# Altium schematic sheet Power.SchDoc
size A2; SheetNumber: 2; SheetTotal: 2
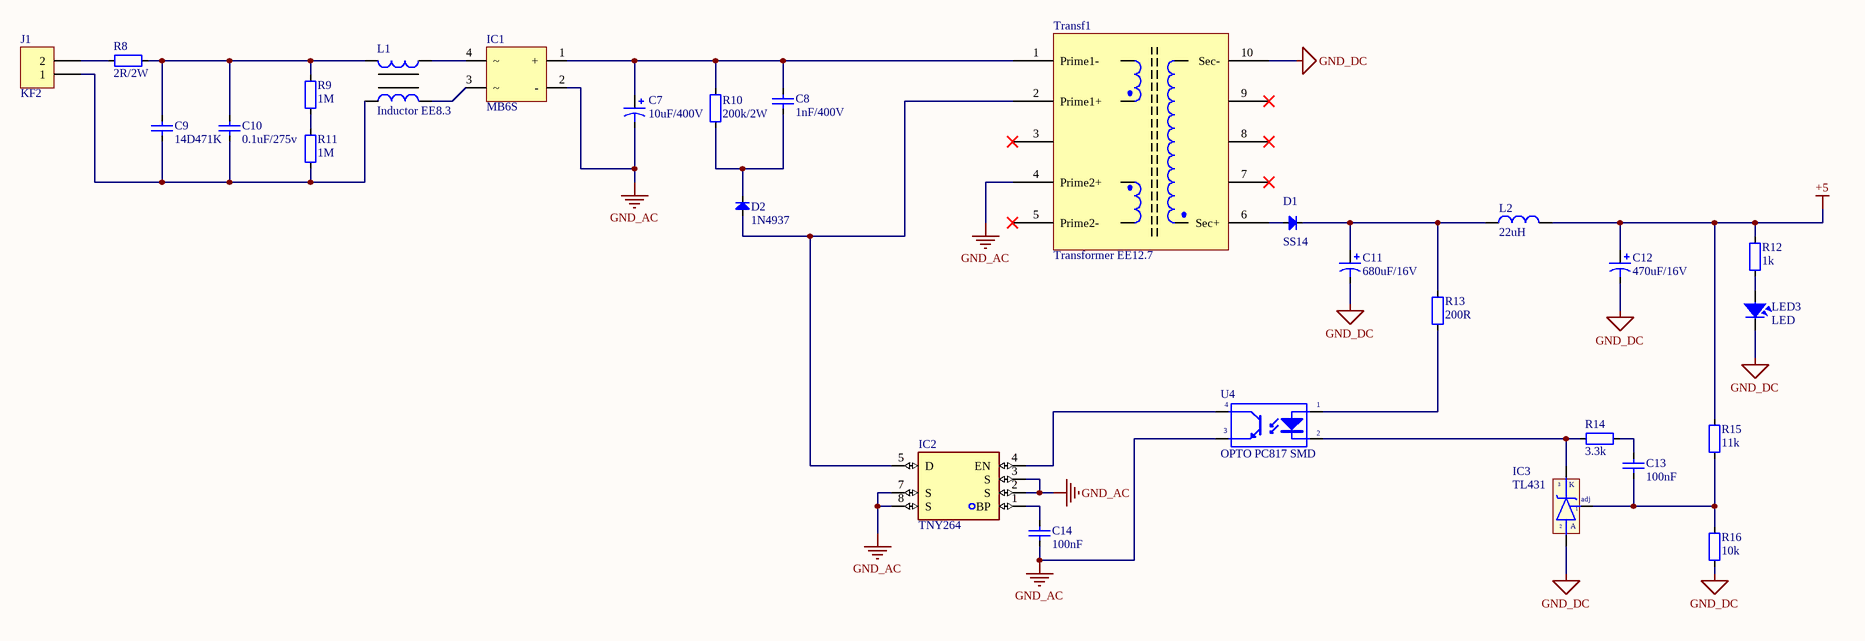
[diagram p0: Power.SchDoc]

## Parts
C7  10uF/400V  [C10mm]
C8  1nF/400V  [103/2KV]
C9  14D471K  [103/2KV]
C10  0.1uF/275v  [Cap AC filter]
C11  680uF/16V  [C8mm]
C12  470uF/16V  [C8mm]
C13  100nF  [CAP_0805]
C14  100nF  [CAP_0805]
D1  SS14  [DO-214AC(SMA)]
D2  1N4937  [DIO-1AN]
IC1  MB6S  [MB6S]
IC2  TNY264  [TNY264]
IC3  TL431  [qto-92]
J1  KF2  [KF2-5.08T]
L1  Inductor EE8.3  [Inductor EE8.3]
L2  22uH  [L_SMD]
LED3  LED  [LED-0805-Red]
R8  2R/2W  [RES-1WW]
R9  1M  [RES-SMD-1206]
R10  200k/2W  [RES-1WW]
R11  1M  [RES-SMD-1206]
R12  1k  [RES-SMD-0805]
R13  200R  [RES-SMD-0805]
R14  3.3k  [RES-SMD-0805]
R15  11k  [RES-SMD-0805]
R16  10k  [RES-SMD-0805]
Transf1  Transformer EE12.7  [Transformer EE12.7]
U4  OPTO PC817 SMD  [SOP4]

## Nets
+5: C12.1 L2.2 R12.2 R15.2
GND_AC: C7.2 C14.1 IC1.2(-) IC2.2(S) IC2.3(S) IC2.7(S) IC2.8(S) Transf1.4(Prime2+) U4.3(E)
GND_DC: C11.2 C12.2 IC3.2(A) LED3.2 R16.1 Transf1.10(Sec-)
NetC7_1: C7.1 C8.1 IC1.1(+) R10.2 Transf1.1(Prime1-)
NetC8_2: C8.2 D2.2(K) R10.1
NetC9_1: C9.1 C10.1 J1.1 L1.4 R11.1
NetC9_2: C9.2 C10.2 L1.2 R8.2 R9.2
NetC11_1: C11.1 D1.2(K) L2.1 R13.2
NetC13_1: C13.1 IC3.1(adj) R15.1 R16.2
NetC13_2: C13.2 R14.1
NetC14_2: C14.2 IC2.1(BP)
NetD1_1: D1.1(A) Transf1.6(Sec+)
NetD2_1: D2.1(A) IC2.5(D) Transf1.2(Prime1+)
NetIC1_3: IC1.3 L1.3
NetIC1_4: IC1.4 L1.1
NetIC2_4: IC2.4(EN) U4.4(C)
NetIC3_3: IC3.3(K) R14.2 U4.2(K)
NetJ1_2: J1.2 R8.1
NetLED3_1: LED3.1 R12.1
NetR9_1: R9.1 R11.2
NetR13_1: R13.1 U4.1(A)

Not connected (* = marked no-connect by the designer): Transf1 3* 5(Prime2-)* 7* 8* 9*

## Library data of the parts
C7 C11 C12 = Cap Pol: Polarized Capacitor (Axial); Published: 8-Jun-2000; LatestRevisionDate: 17-Jul-2002; LatestRevisionNote: Re-released for DXP Platform.; PackageReference: POLAR0.8; Publisher: Altium Limited
C8 = Cap2KV: CAP CERAMIC; Published: 8-Jun-2000; LatestRevisionDate: 17-Jul-2002; LatestRevisionNote: Re-released for DXP Platform.; PackageReference: RAD-0.3; Publisher: Altium Limited
C9 = Cap2KV: Capacitor Ceramic 2KV; Published: 8-Jun-2000; LatestRevisionDate: 17-Jul-2002; LatestRevisionNote: Re-released for DXP Platform.; PackageReference: RAD-0.3; Publisher: Altium Limited
C10 = Cap AC filter: Tụ lọc nguồn AC 0.1uf 275v 10mm
C13 C14 = CapSMD: Capacitor; Value: 33p; Published: 8-Jun-2000; LatestRevisionDate: 17-Jul-2002; LatestRevisionNote: Re-released for DXP Platform.; PackageReference: RAD-0.3; Publisher: Altium Limited
D1 = Diode SMD: Diode Schottky / 1N5819; Code - JEDEC: DO-214-AB; Value: 1N5007; Published: 8-Jun-2000; Revision: July-2002: Re-released for DXP Platform.; Publisher: Altium Limited
D2 = Diode SMD: Diode Schottky / 1N4937; Code - JEDEC: DO-214-AB; Value: 1N5007; Published: 8-Jun-2000; Revision: July-2002: Re-released for DXP Platform.; Publisher: Altium Limited
IC2 = TNY264: IC Power
IC3 = TL431: Programmable Shunt Regulator; Value: TL431
J1 = KF2: Manufacturer: Würth Elektronik eiSos GmbH; partNo: 691103110002; ComponentLink1 Description: Manufacturer; ComponentLink2 Description: Datasheet; NoPins: 2; Created Date: 29 October 2013; ComponentLink1URL: http://www.we-online.com; ComponentLink2URL: http://katalog.we-online.de/em/datasheet/6911031100xx.pdf; Created by: Karrer Zheng
L2 = Inductor: CD73R 22uH 1.23A 7345; Value: 150 mH
LED3 = LED: LED Single colour Green and Red; Value: LED 3 ly Single Colour
R8-R16 = Resistor - SMD: Resistor; Manufacturer: Generic Components; Class: Passive; Published: 08/06/2000; Publisher: Altium Hobart Technology Centre
Transf1 = Tranformer EE16
U4 = OPTO PC817 SMD: Single Opto; Value: PC817